# EasyEDA Pro project ProPrj_gpsdo-Phil1_2025-08-17.epro

# Schematic gpsdo
Board Name: gpsdo; Create Date: 2024-10-21; Page Name: gpsdo; Project Name: gpsdo-Phil1; Schematic Name: gpsdo; Update Date: 2024-11-19; Add into BOM: yes; Company: Your Company; Convert to PCB: yes; Date: 2024-08-26; Draw By: 一蓑烟雨任平生; REV: 1.0; Sheet: 1/1
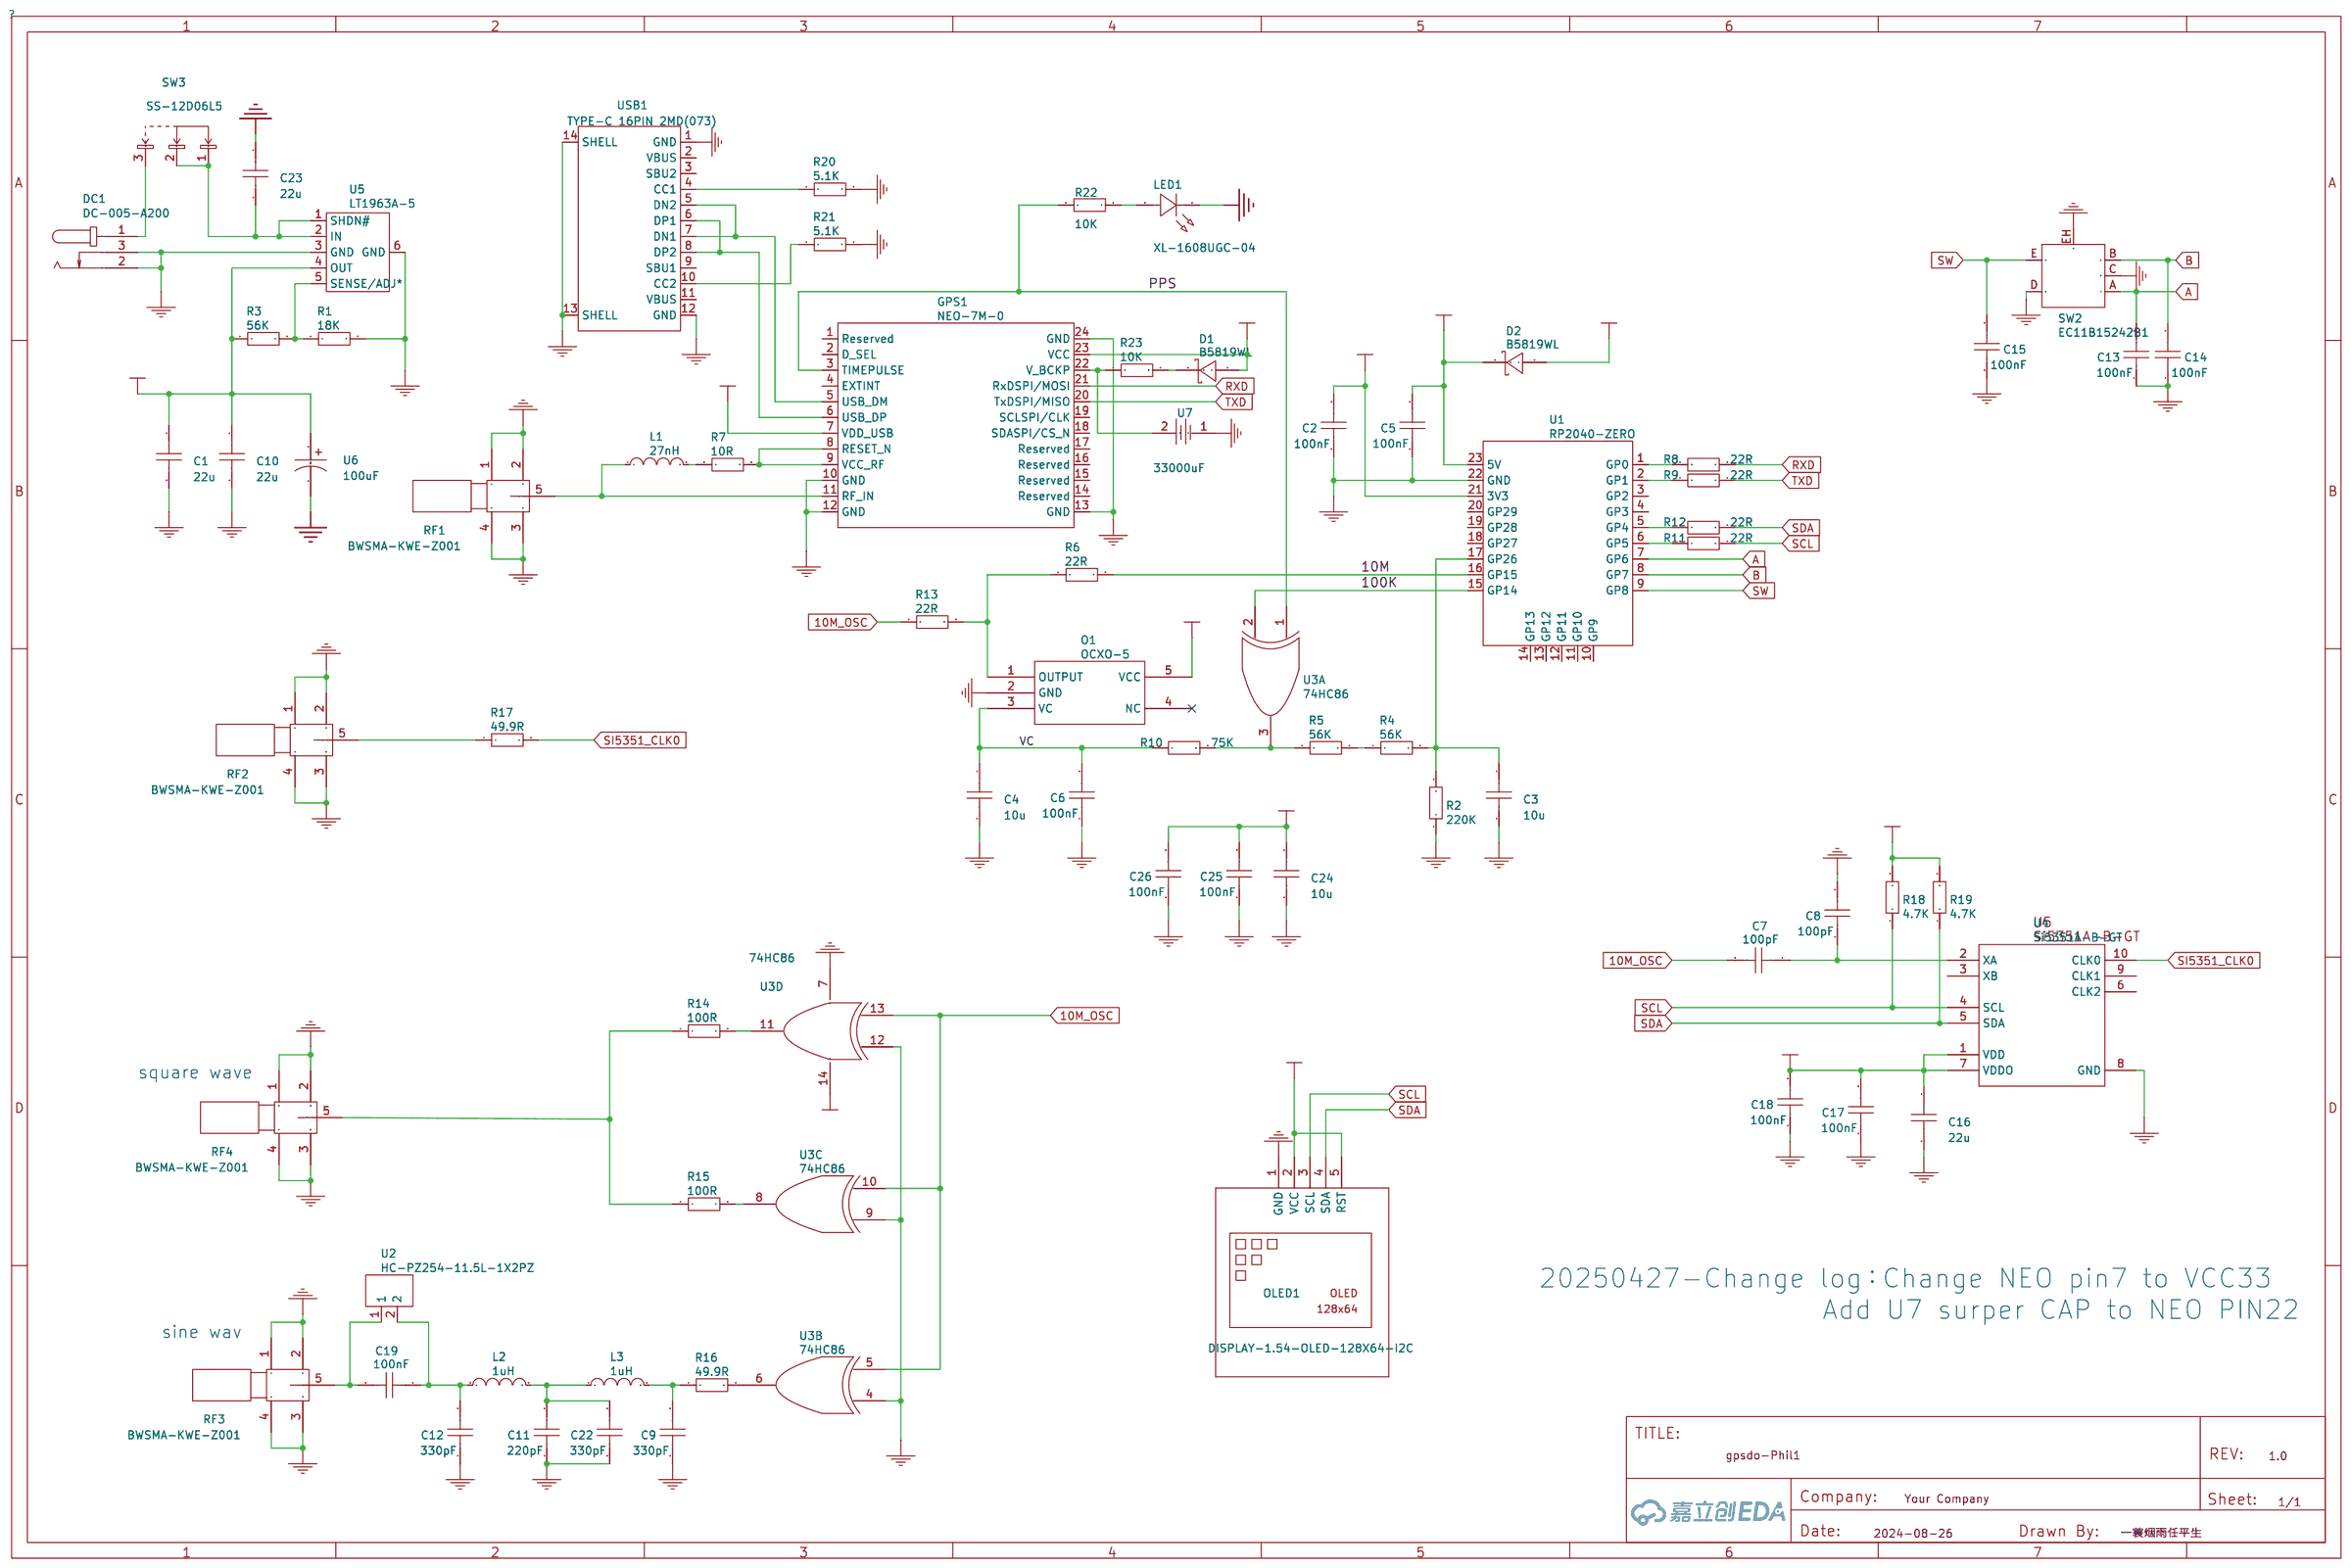
[diagram p0: schematic sheet]

## Parts
C1  22u  [C0805]
C2  100nF  [C0603]
C3  10u  [C0805]
C4  10u  [C0805]
C5  100nF  [C0603]
C6  100nF  [C0603]
C7  100pF  [C0603]
C8  100pF  [C0603]
C9  330pF  [C0603]
C10  22u  [C0805]
C11  220pF  [C0603]
C12  330pF  [C0603]
C13  100nF  [C0603]
C14  100nF  [C0603]
C15  100nF  [C0603]
C16  22u  [C0805]
C17  100nF  [C0603]
C18  100nF  [C0603]
C19  100nF  [C0603]
C22  330pF  [C0603]
C23  22u  [C0805]
C24  10u  [C0805]
C25  100nF  [C0603]
C26  100nF  [C0603]
D1  B5819WL  [SOD-123F_L2.8-W1.8-LS3.7-RD]
D2  B5819WL  [SOD-123F_L2.8-W1.8-LS3.7-RD]
DC1  DC-005-A200  [DC-IN-TH_DC-005-A200]
GPS1  NEO-7M-0  [GPS-SMD_NEO-7M-0]
L1  27nH  [L0603]
L2  1uH  [IND-SMD_L2.3-W1.7-1]
L3  1uH  [IND-SMD_L2.3-W1.7-1]
LED1  XL-1608UGC-04  [LED0603-RD_GREEN]
O1  OCXO-5  [OCXO-5]
OLED1  DISPLAY-1.54-OLED-128X64-I2C  [CONN-TH_XH2.54-5P]
R1  18K  [R0603]
R2  220K  [R0603]
R3  56K  [R0603]
R4  56K  [R0603]
R5  56K  [R0603]
R6  22R  [R0603]
R7  10R  [R0603]
R8  22R  [R0603]
R9  22R  [R0603]
R10  75K  [R0603]
R11  22R  [R0603]
R12  22R  [R0603]
R13  22R  [R0603]
R14  100R  [R0603]
R15  100R  [R0603]
R16  49.9R  [R0603]
R17  49.9R  [R0603]
R18  4.7K  [R0603]
R19  4.7K  [R0603]
R20  5.1K  [R0603]
R21  5.1K  [R0603]
R22  10K  [R0603]
R23  10K  [R0603]
RF1  BWSMA-KWE-Z001  [SMA-TH_BWSMA-KWE-Z001]
RF2  BWSMA-KWE-Z001  [SMA-TH_BWSMA-KWE-Z001]
RF3  BWSMA-KWE-Z001  [SMA-TH_BWSMA-KWE-Z001]
RF4  BWSMA-KWE-Z001  [SMA-TH_BWSMA-KWE-Z001]
SW2  EC11B15242B1  [SW-TH_EC11B1524XX]
SW3  SS-12D06L5  [SW-TH_3P-P4.70_L11.1-W12.7]
U1  RP2040-ZERO  [COMM-SMD_RP2040-ZERO]
U2  HC-PZ254-11.5L-1X2PZ  [CONN-TH_HC-PZ254-11.5L-1X2PZ]
U3  74HC86  [SOP-14]  (sections 1,2,3,4)
U4  Si5351A-B-GT  [SI5351A-B-GT-MSOP-10_L3.0-W3.0-P0.50-LS5.0-BL]
U5  LT1963A-5  [DD-PAK-5_L10.6-W10.3-P1.70-LS14.5-BR]
U6  100uF  [CAP-SMD_BD6.3-L6.6-W6.6-LS7.3-FD]
U7  33000uF  [BAT-SMD_SM3R3333-T01]
USB1  TYPE-C 16PIN 2MD(073)  [USB-C-SMD_TYPE-C-6PIN-2MD-073]

## Library data of the parts
C1 C3 C4 C10 C16 C23 C24 = CAP_0805: 容值:100nF;精度:±10%;额定电压:50V;温度系数:X7R;; Supplier Footprint: 0805
C2 C5 C6 C13-C15 C17-C19 C25 C26 = 100nF: Supplier: LCSC; Manufacturer: YAGEO; Manufacturer Part: CC0603KRX7R9BB104; Supplier Part: C14663; JLCPCB Part Class: Basic Part
C7 C8 = 100pF: Supplier: LCSC; Manufacturer: YAGEO; Manufacturer Part: CC0603KRX7R9BB104; Supplier Part: C14663; JLCPCB Part Class: Basic Part
C9 C12 C22 = 330pF: Supplier: LCSC; Manufacturer: YAGEO; Manufacturer Part: CC0603KRX7R9BB104; Supplier Part: C14663; JLCPCB Part Class: Basic Part
C11 = 220pF: Supplier: LCSC; Manufacturer: YAGEO; Manufacturer Part: CC0603KRX7R9BB104; Supplier Part: C14663; JLCPCB Part Class: Basic Part
D1 D2 = B5819WL: Supplier: LCSC; Manufacturer: SHIKUES(时科); Supplier Part: C112447; JLCPCB Part Class: Extended Part
DC1 = DC-005-A200: Supplier: LCSC; Supplier Part: C720557; Manufacturer: XUNPU(讯普); JLCPCB Part Class: Extended Part; link: https://so.szlcsc.com/global.html?k=C720557&amp;ref=editor
GPS1 = NEO-7M-0: Supplier: LCSC; Supplier Part: C6612031; Manufacturer: U-BLOX
L1 = 27nH: Supplier: LCSC; Supplier Part: C162649; Manufacturer: muRata(村田); JLCPCB Part Class: Extended Part
L2 L3 = 1uH: Supplier: LCSC; Supplier Part: C363974; Manufacturer: Sunltech(韩国顺磁); JLCPCB Part Class: Extended Part
LED1 = XL-1608UGC-04: 灯头类型:-;发光颜色:翠绿色;正向电压(VF):-;功率:80mW;正向电流:25mA;主波长:516nm~525nm;二极管配置:独立二极管;透镜颜色:无色透明透镜;色温:-;发光强度:-;发光角度:120°;载带方式:正贴;工作温度:-30℃~+85℃;; Supplier Part: C965804; Manufacturer: XINGLIGHT(成兴光); Supplier Footprint: 0603; JLCPCB Part Class: 扩展库; Datasheet: https://atta.szlcsc.com/upload/public/pdf/source/20221102/520D6E465E5CFD1609C8A4DBC80D4018.pdf; Supplier: LCSC; Emitted Color: 翠绿色; Power Dissipation: 80mW; Forward Current: 25mA; Dominant Wavelength: 516nm~525nm; Peak Wavelength: 534nm; Diode Configuration: 独立二极管; Lens Color: 无色透明透镜; Viewing Angle: 120°; Mounting Sytle: 正贴; Operating Temperature: -30℃~+85℃
O1 = OCXO-5
OLED1 = DISPLAY-1.54-OLED-128X64-I2C
R1 R23 = 2.4K: Supplier: LCSC; Manufacturer: UniOhm; Manufacturer Part: 0603WAF1002T5E; Supplier Part: C25804; JLCPCB Part Class: Basic
R2 = 220K: Supplier: LCSC; Manufacturer: UniOhm; Manufacturer Part: 0603WAF1002T5E; Supplier Part: C25804; JLCPCB Part Class: Basic
R3 = 10K: Supplier: LCSC; Manufacturer: UniOhm; Manufacturer Part: 0603WAF1002T5E; Supplier Part: C25804; JLCPCB Part Class: Basic
R4 R5 = 56K: Supplier: LCSC; Manufacturer: UniOhm; Manufacturer Part: 0603WAF1002T5E; Supplier Part: C25804; JLCPCB Part Class: Basic
R6 R8 R9 R11-R13 = 22R: Supplier: LCSC; Manufacturer: UniOhm; Manufacturer Part: 0603WAF1002T5E; Supplier Part: C25804; JLCPCB Part Class: Basic
R7 = 10R: Supplier: LCSC; Manufacturer: UniOhm; Manufacturer Part: 0603WAF1002T5E; Supplier Part: C25804; JLCPCB Part Class: Basic
R10 = 75K: Supplier: LCSC; Manufacturer: UniOhm; Manufacturer Part: 0603WAF1002T5E; Supplier Part: C25804; JLCPCB Part Class: Basic
R14 R15 = 100R: Supplier: LCSC; Manufacturer: UniOhm; Manufacturer Part: 0603WAF1002T5E; Supplier Part: C25804; JLCPCB Part Class: Basic
R16 R17 = 49.9R: Supplier: LCSC; Manufacturer: UniOhm; Manufacturer Part: 0603WAF1002T5E; Supplier Part: C25804; JLCPCB Part Class: Basic
R18 R19 R22 = 4.7K: Supplier: LCSC; Manufacturer: UniOhm; Manufacturer Part: 0603WAF1002T5E; Supplier Part: C25804; JLCPCB Part Class: Basic
R20 R21 = 5.1K: Supplier: LCSC; Manufacturer: UniOhm; Manufacturer Part: 0603WAF1002T5E; Supplier Part: C25804; JLCPCB Part Class: Basic
RF1-RF4 = BWSMA-KWE-Z001: Supplier: LCSC; Supplier Part: C496551; Manufacturer: BAT WIRELESS(蝙蝠无线); JLCPCB Part Class: Extended Part
SW2 = EC11B15242B1: Supplier: LCSC; Supplier Part: C470755; Manufacturer: ALPSALPINE(阿尔卑斯阿尔派); JLCPCB Part Class: Extended Part
SW3 = SS-12D06L5: 电路结构:单刀双掷;安装方式:侧插;开关颜色:黑色;额定电流(DC):3A;额定电压(DC):250V;额定电流(AC):3A;额定电压(AC):250V;机械寿命:1万次;; LCSC Part Name: 柄长5mm 卧插双档 滑动开关; Supplier Part: C319015; Manufacturer: XKB Connectivity(中国星坤); Supplier Footprint: 插件; JLCPCB Part Class: 扩展库; Datasheet: https://atta.szlcsc.com/upload/public/pdf/source/20211009/0D67854FD60FB1F6FE75130AD47C052C.pdf; Supplier: LCSC; Circuit: 单刀双掷; Actuator Style: 矩形柱状; Pin Style: PC引脚; Switch Length: 12.95mm; Switch Width: 6.6mm; Switch Height: 6.3mm; Mounting Style: 侧插; Actuator Color: 黑色; Current Rating (DC): 3A; Voltage Rating (DC): 250V; Current Rating (AC): 3A; Voltage Rating (AC): 250V; Mechanical Life: 1万次; Operating Temperature: -40℃~+85℃
U1 = RP2040-ZERO: Supplier: LCSC; Supplier Part: C5350143; Manufacturer: Waveshare(微雪电子); JLCPCB Part Class: Extended Part
U2 = HC-PZ254-11.5L-1X2PZ: Supplier: LCSC; Supplier Part: C27985187; Manufacturer: HC(虹成电子); Manufacturer Part: HC-PZ254-11.5L-1x2PZ
U3 = 74HC86
U4 = Si5351A-B-GT
U5 = LT1963A-5: Supplier: LCSC; Supplier Part: C665682; Manufacturer: Analog Devices; Manufacturer Part: LT1963AEQ-1.8#PBF; JLCPCB Part Class: Extended Part
U6 = 118EC221: 容值:100uF;精度:±20%;额定电压:25V;; LCSC Part Name: 100uF ±20% 25V; Supplier Part: C5361260; Manufacturer: KNSCHA(科尼盛); Supplier Footprint: SMD,D6.3xL5.9mm; JLCPCB Part Class: 扩展库; Datasheet: https://atta.szlcsc.com/upload/public/pdf/source/20230214/DF1300D15D4E0E75CD3AD09AED3A8200.pdf; Supplier: LCSC; Tolerance: ±20%; Rated Voltage: 25V
U7 = SM3R3333 T01: 容值:33000uF;精度:-20%~+80%;额定电压:3.3V;漏电流:100uA@30mins;等效串联电阻:200Ω@1kHz;; LCSC Part Name: 33000uF -20%~+80% 3.3V; Supplier Part: C260765; Manufacturer: KORCHIP(高奇普); Supplier Footprint: SMD,1.5x3.8mm; JLCPCB Part Class: 扩展库; Datasheet: https://atta.szlcsc.com/upload/public/pdf/source/20190514/C260765_F6ACC1E70F2A9EFDD36435F7B2A4C259.pdf; Supplier: LCSC; Tolerance: -20%~+80%; Rated Voltage: 3.3V; Leakage Current(DCL): 100uA@30mins; Equivalent Series Resistance(ESR): 200Ω@1kHz; Operating Temperature: -25℃~+60℃; φD: 3.8mm
USB1 = TYPE-C 16PIN 2MD(073): Supplier: LCSC; Supplier Part: C2765186; Manufacturer: SHOU HAN(首韩); JLCPCB Part Class: Extended Part

## Nets
+5V: C1.1 C10.1 C24.1 C25.2 C26.2 D2.2(A) O1.5(VCC) R3.1 U3.14 U5.4(OUT) U6.1
+5V_PICO: C5.2 D2.1(K) U1.23(5V)
GND: C1.2 C2.1 C3.2 C4.2 C5.1 C6.1 C8.2 C9.1 C10.2 C11.1 C12.1 C13.1 C14.1 C15.1 C16.2 C17.1 C18.1 C22.1 C23.1 C24.2 C25.1 C26.1 DC1.2 DC1.3 GPS1.10(GND) GPS1.12(GND) GPS1.13(GND) GPS1.24(GND) LED1.1(K) O1.2(GND) OLED1.1(GND) R1.2 R2.1 R20.2 R21.2 RF1.1 RF1.2 RF1.3 RF1.4 RF2.1 RF2.2 RF2.3 RF2.4 RF3.1 RF3.2 RF3.3 RF3.4 RF4.1 RF4.2 RF4.3 RF4.4 SW2.C SW2.D SW2.EH U1.22(GND) U3.4 U3.7 U3.9 U3.12 U4.8(GND) U5.3(GND) U5.6(GND) U6.2 U7.1 USB1.1(GND) USB1.12(GND) USB1.13(SHELL) USB1.14(SHELL)
VCC33: C2.2 C16.1 C17.2 C18.2 D1.2(A) GPS1.7(VDD_USB) GPS1.23(VCC) OLED1.2(VCC) OLED1.5(RST) R18.2 R19.2 U1.21(3V3) U4.1(VDD) U4.7(VDDO)
10M: R6.2 U1.16(GP15)
10M_OSC: C7.2 R13.1 U3.5 U3.10 U3.13
100K: U1.15(GP14) U3.2
A: C13.2 SW2.A U1.7(GP6)
B: C14.2 SW2.B U1.8(GP7)
PPS: GPS1.3(TIMEPULSE) R22.2 U3.1
RXD: GPS1.21(RxDSPI/MOSI) R8.2
SCL: OLED1.3(SCL) R11.2 R18.1 U4.4(SCL)
SDA: OLED1.4(SDA) R12.2 R19.1 U4.5(SDA)
SI5351_CLK0: R17.2 U4.10(CLK0)
SW: C15.2 SW2.E U1.9(GP8)
TXD: GPS1.20(TxDSPI/MISO) R9.2
VC: C4.1 C6.2 O1.3(VC) R10.1
$1N1: C23.2 SW3.1 SW3.2 U5.1(SHDN#) U5.2(IN)
$1N4: R1.1 R3.2 U5.5(SENSE/ADJ*)
$1N11: C3.1 R2.2 R4.2 U1.17(GP26)
$1N15: R4.1 R5.2
$1N20: O1.1(OUTPUT) R6.1 R13.2
$1N25: GPS1.11(RF_IN) L1.1 RF1.5
$1N26: GPS1.8(RESET_N) GPS1.9(VCC_RF) R7.2
$1N28: L1.2 R7.1
$1N35: R8.1 U1.1(GP0)
$1N36: R9.1 U1.2(GP1)
$1N37: R5.1 R10.2 U3.3
$1N42: R12.1 U1.5(GP4)
$1N43: R11.1 U1.6(GP5)
$1N54: R14.2 U3.11
$1N55: R15.2 U3.8
$1N56: R14.1 R15.1 RF4.5
$1N59: C7.1 C8.1 U4.2(XA)
$1N63: C11.2 C22.2 L2.2 L3.1
$1N64: C9.2 L3.2 R16.1
$1N65: C12.2 C19.1 L2.1 U2.2
$1N84: R17.1 RF2.5
$1N90: GPS1.6(USB_DP) USB1.6(DP1) USB1.8(DP2)
$1N91: GPS1.5(USB_DM) USB1.5(DN2) USB1.7(DN1)
$1N92: R20.1 USB1.4(CC1)
$1N93: R21.1 USB1.10(CC2)
$1N95: C19.2 RF3.5 U2.1
$1N1366: R16.2 U3.6
$1N3339: DC1.1 SW3.3
$1N3564: LED1.2(A) R22.1
$1N8329: D1.1(K) R23.2
$1N8333: GPS1.22(V_BCKP) R23.1 U7.2

Not connected (* = marked no-connect by the designer): GPS1 1(Reserved) 2(D_SEL) 4(EXTINT) 14(Reserved) 15(Reserved) 16(Reserved) 17(Reserved) 18(SDASPI/CS_N) 19(SCLSPI/CLK); O1 4(NC)*; U1 3(GP2) 4(GP3) 10(GP9) 11(GP10) 12(GP11) 13(GP12) 14(GP13) 18(GP27) 19(GP28) 20(GP29); U4 3(XB) 6(CLK2) 9(CLK1); USB1 2(VBUS) 3(SBU2) 9(SBU1) 11(VBUS)

## Notes on the sheet
- square wave
- 20250427-Change log：Change NEO pin7 to VCC33
- Add U7 surper CAP to NEO PIN22
- sine wav

# Board gpsdo-phil
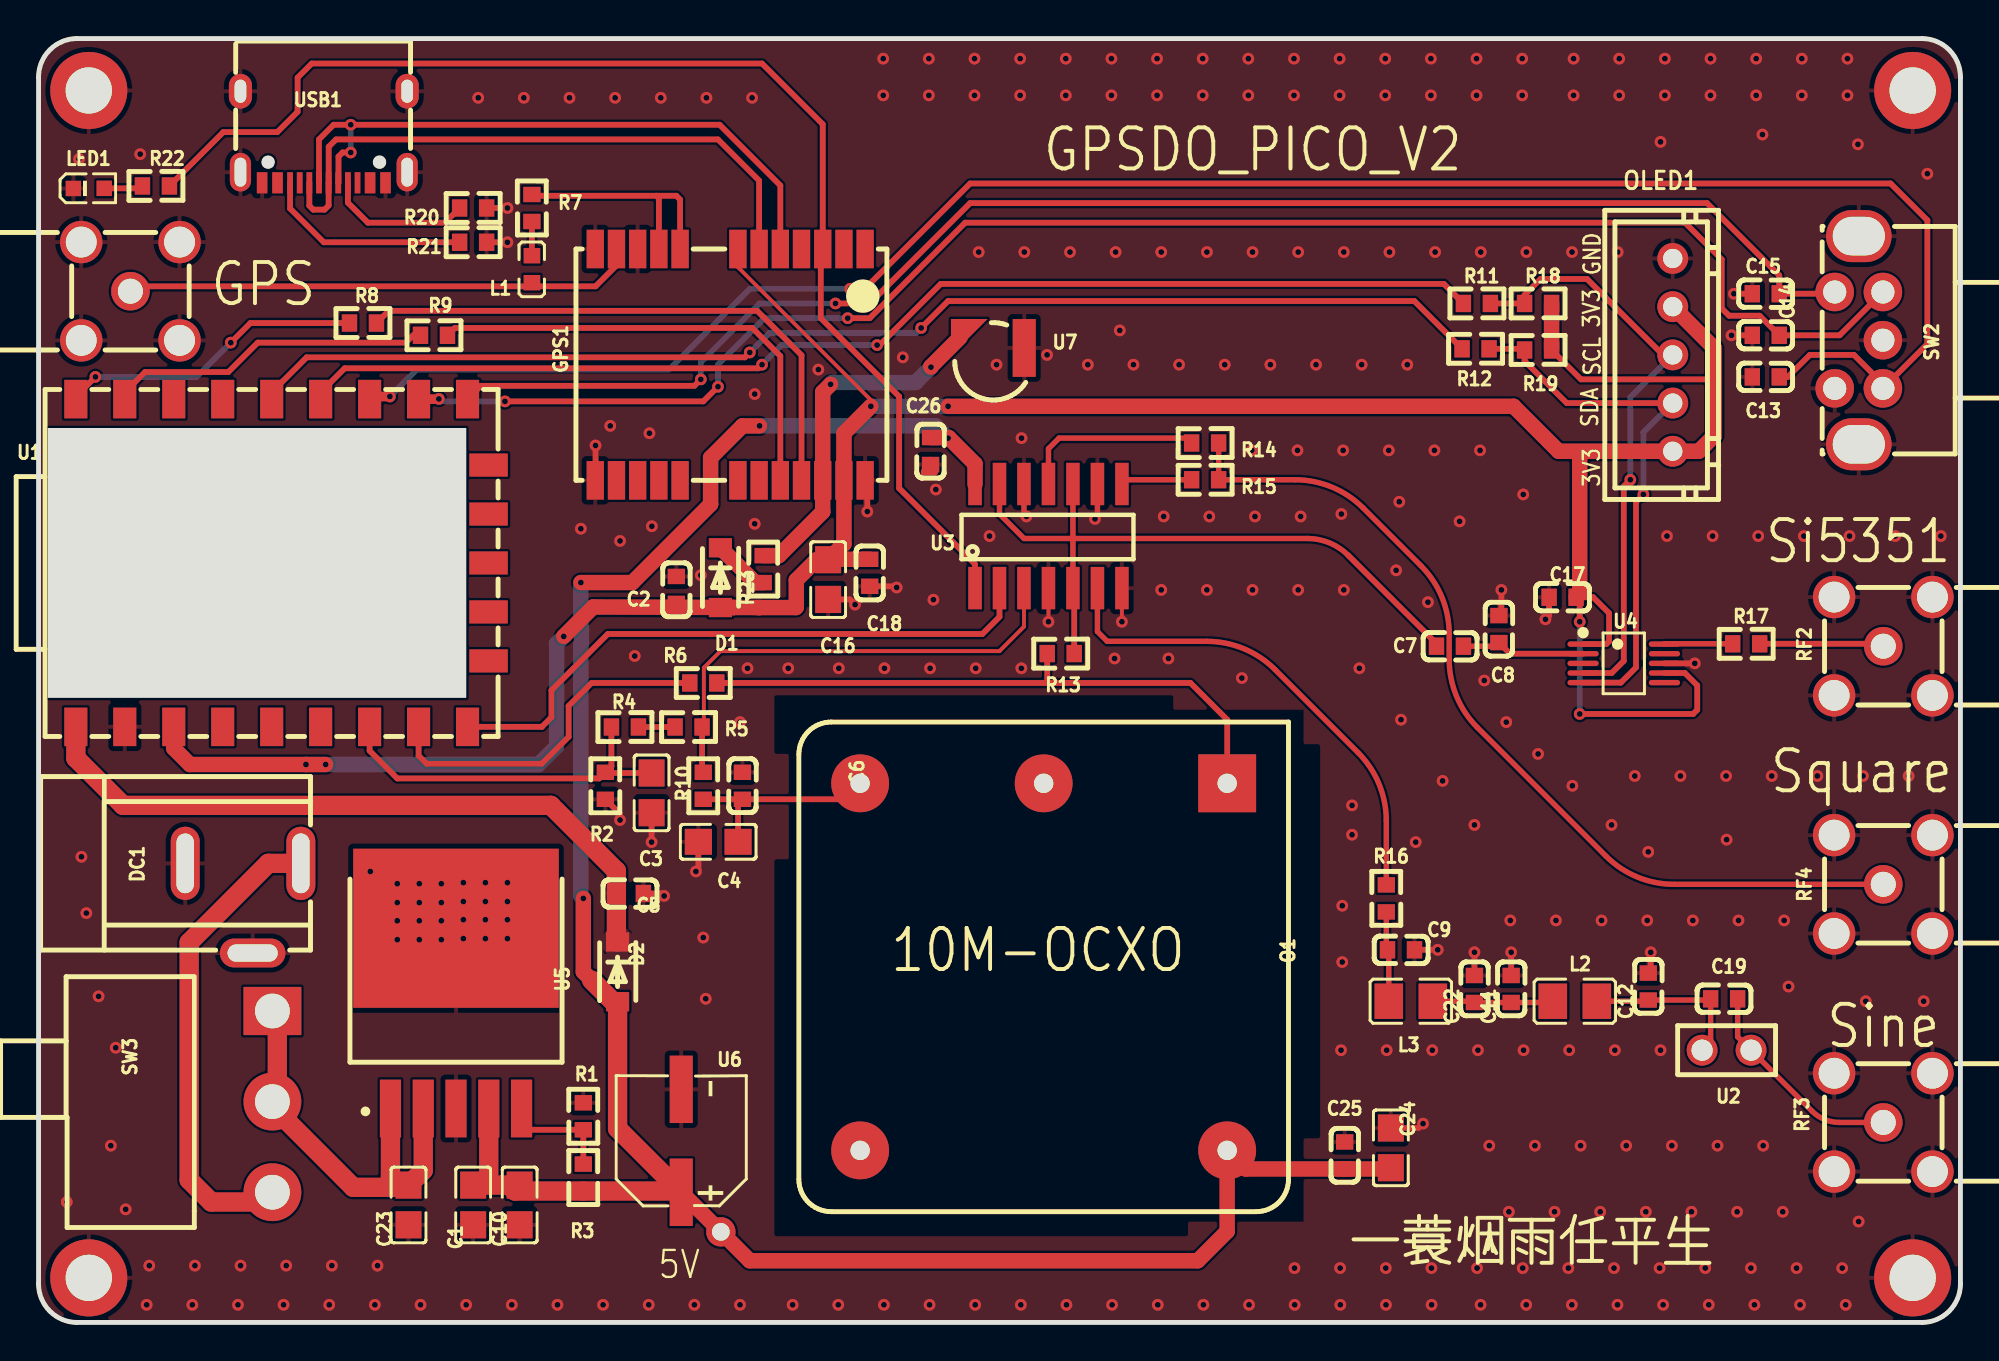
[diagram p1: board, top side]
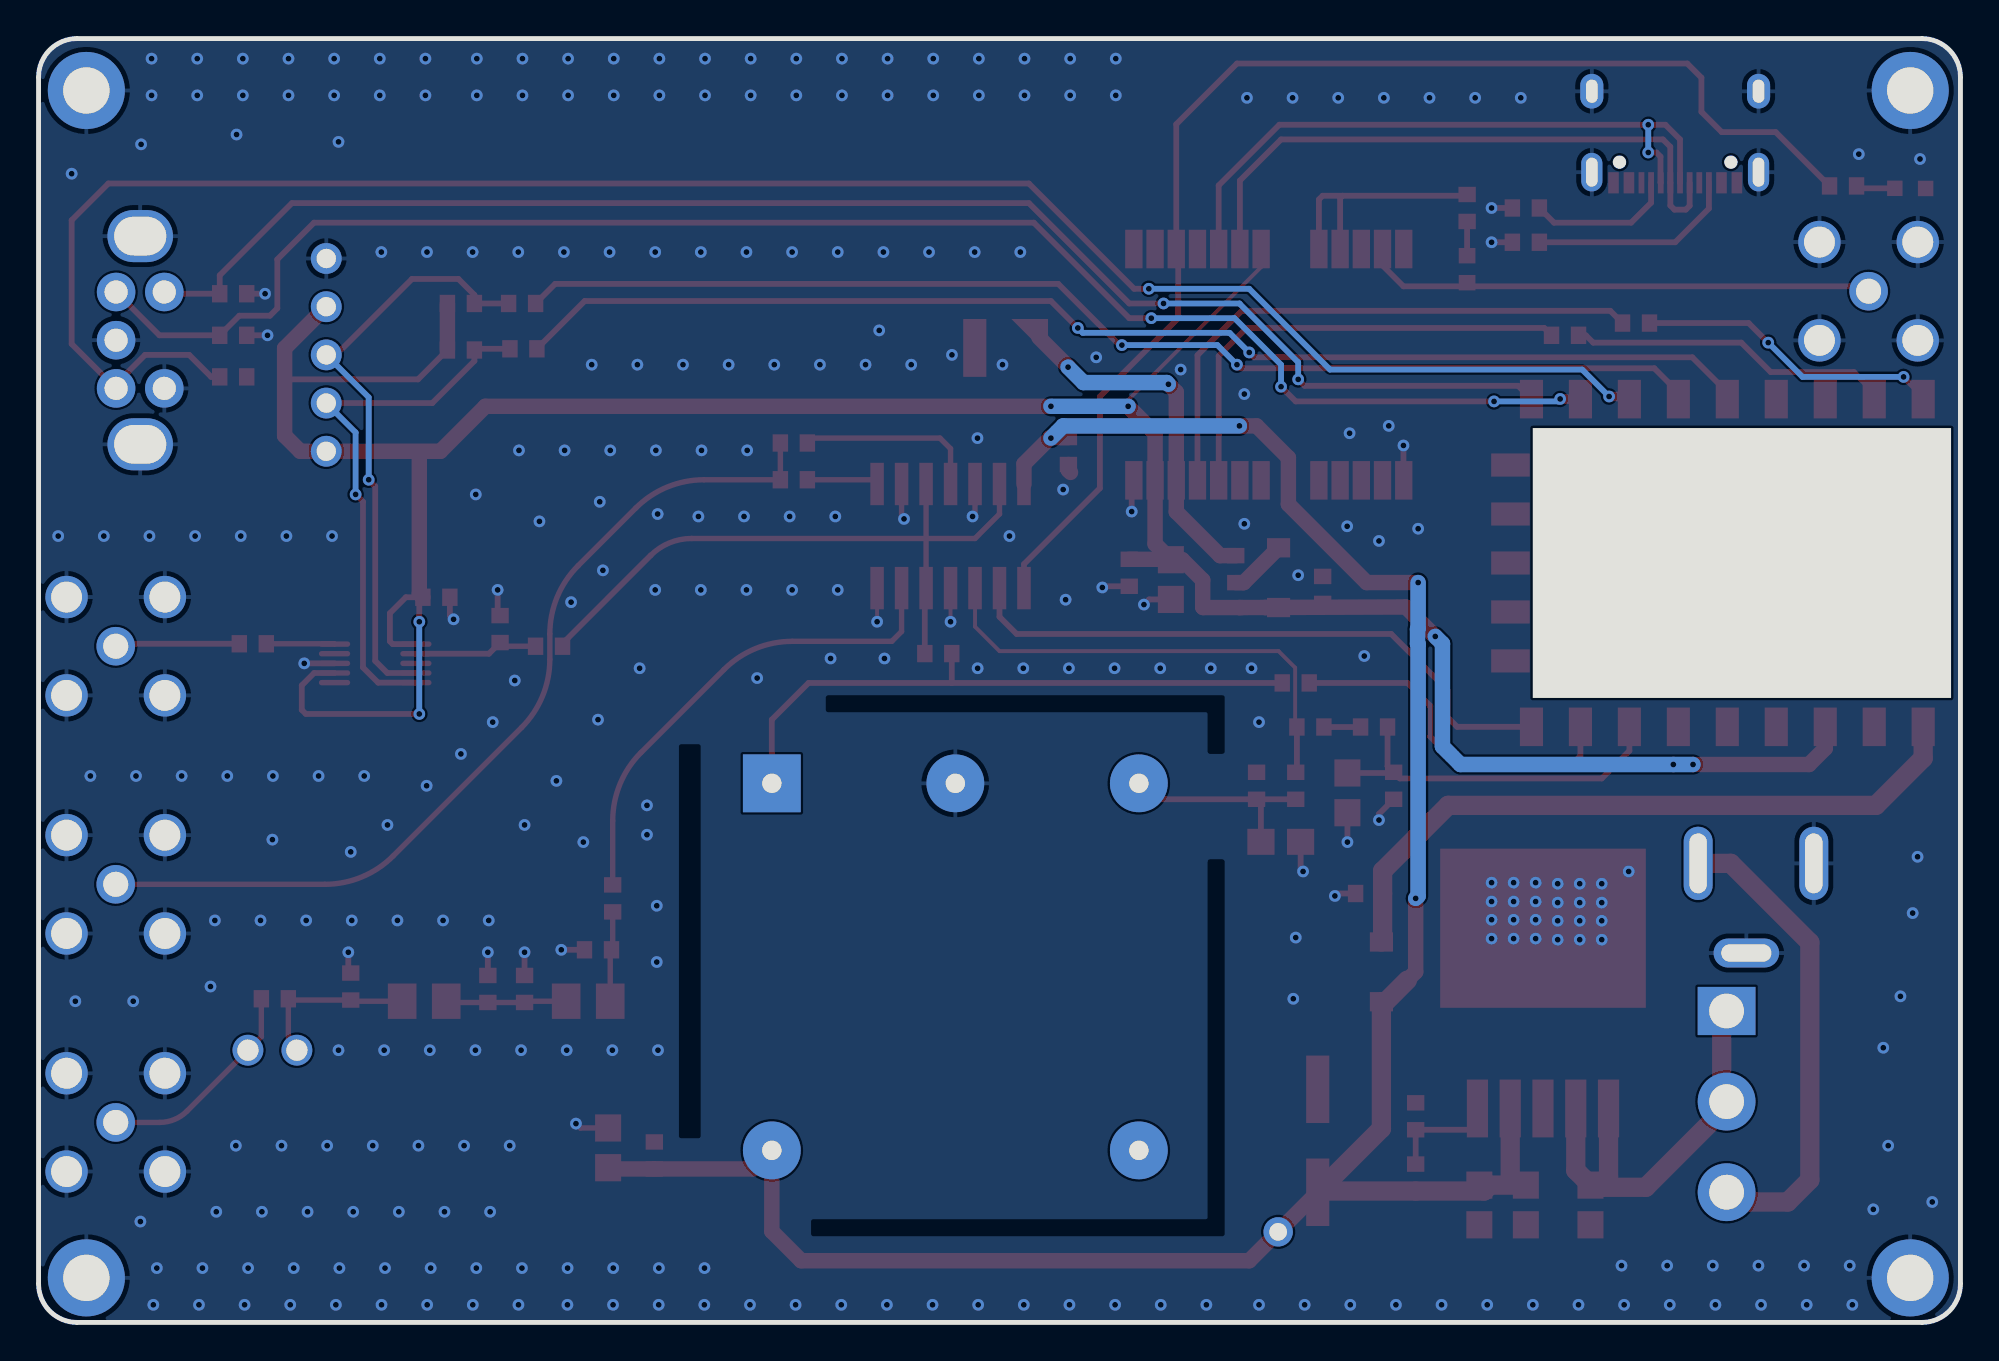
[diagram p2: board, bottom side, seen from below]

Outline 99.7 x 66.6 mm; copper layers: Top Layer, Bottom Layer. Coordinates in mm from the lower left corner of the outline.
Outline path: 0,64.6 0,2 arc(0.59,0.59) 2,0 97.7,0 arc(99.11,0.59) 99.7,2 99.7,64.6 arc(99.11,66.01) 97.7,66.6 2,66.6 arc(0.59,66.01) 0,64.6
Stack: Top Layer 0.035mm / Dielectric1 1.51mm FR4 er 4.5 / Bottom Layer 0.035mm

## Design rules (mm)
spacing Default (default): track to track 0.12, other pairs 0 to 0.12
track width Default (default): min 0.12, default 0.12, max 25.4
differential pair differentialPair (default): width min 0.127, default 0.254, max 2.54; gap min 0.152, default 0.152
via Default (default): diameter min 0.45, default 0.45, max 100.025; hole min 0.2, default 0.2, max 59.995

## Placement (name value [footprint] x y rotation side)
C1  22u  [C0805]  22.55 6.09 270 top
C2  100nF  [C0603]  33.09 38 270 top
C3  10u  [C0805]  31.8 27.47 270 top
C4  10u  [C0805]  35.26 24.93 180 top
C5  100nF  [C0603]  30.68 22.25 180 top
C6  100nF  [C0603]  36.52 27.84 270 top
C7  100pF  [C0603]  73.22 35.08 180 top
C8  100pF  [C0603]  75.76 35.97 90 top
C9  330pF  [C0603]  70.68 19.33 180 top
C10  22u  [C0805]  24.96 6.09 270 top
C11  220pF  [C0603]  76.39 17.3 270 top
C12  330pF  [C0603]  83.5 17.43 270 top
C13  100nF  [C0603]  89.6 49.05 0 top
C14  100nF  [C0603]  89.6 51.21 0 top
C15  100nF  [C0603]  89.6 53.36 0 top
C16  22u  [C0805]  40.96 38.54 270 top
C17  100nF  [C0603]  79.06 37.62 0 top
C18  100nF  [C0603]  43.12 38.89 90 top
C19  100nF  [C0603]  87.44 16.79 0 top
C22  330pF  [C0603]  74.49 17.3 270 top
C23  22u  [C0805]  19.19 6.09 90 top
C24  10u  [C0805]  70.15 9.06 90 top
C25  100nF  [C0603]  67.76 8.66 270 top
C26  100nF  [C0603]  46.27 45.2 90 top
D1  B5819WL  [SOD-123F_L2.8-W1.8-LS3.7-RD]  35.37 38.63 270 top
D2  B5819WL  [SOD-123F_L2.8-W1.8-LS3.7-RD]  30.04 18.19 270 top
DC1  DC-005-A200  [DC-IN-TH_DC-005-A200]  10.61 21.49 0 top
GPS1  NEO-7M-0  [GPS-SMD_NEO-7M-0]  35.88 49.68 180 top
L1  27nH  [L0603]  25.59 54.64 90 top
L2  1uH  [IND-SMD_L2.3-W1.7-1]  79.69 16.66 180 top
L3  1uH  [IND-SMD_L2.3-W1.7-1]  71.19 16.66 180 top
LED1  XL-1608UGC-04  [LED0603-RD_GREEN]  2.61 58.83 0 top
NOREF  -  [Pad_e4136]  2.61 2.31 0 top
NOREF#2  -  [Pad_e4129]  97.22 63.91 0 top
NOREF#3  -  [Pad_e4128]  2.61 63.91 0 top
NOREF#4  -  [Pad_e4137]  97.22 2.31 0 top
NOREF#5  -  [Pad_e296]  35.4 4.7 0 top
O1  -  [OCXO-5]  61.66 27.97 270 top
OLED1  DISPLAY-1.54-OLED-128X64-I2C  [CONN-TH_XH2.54-5P]  84.78 50.19 270 top
R1  18K  [R0603]  28.26 10.69 90 top
R2  220K  [R0603]  29.4 27.84 90 top
R3  56K  [R0603]  28.26 7.52 90 top
R4  56K  [R0603]  30.42 30.89 180 top
R5  56K  [R0603]  33.72 30.89 180 top
R6  22R  [R0603]  34.48 33.17 180 top
R7  10R  [R0603]  25.59 57.81 90 top
R8  22R  [R0603]  16.83 51.84 0 top
R9  22R  [R0603]  20.51 51.21 0 top
R10  75K  [R0603]  34.48 27.84 90 top
R11  22R  [R0603]  74.62 52.86 0 top
R12  22R  [R0603]  74.55 50.51 0 top
R13  22R  [R0603]  53.03 34.7 180 top
R14  100R  [R0603]  60.52 45.62 180 top
R15  100R  [R0603]  60.52 43.71 180 top
R16  49.9R  [R0603]  69.92 22 90 top
R17  49.9R  [R0603]  88.59 35.21 180 top
R18  4.7K  [R0603]  77.79 52.86 0 top
R19  4.7K  [R0603]  77.79 50.45 0 top
R20  5.1K  [R0603]  22.55 57.81 0 top
R21  5.1K  [R0603]  22.55 56.03 0 top
R22  10K  [R0603]  6.09 58.95 0 top
R23  10K  [R0603]  37.59 39.08 270 top
RF1  BWSMA-KWE-Z001  [SMA-TH_BWSMA-KWE-Z001]  4.77 53.49 180 top
RF2  BWSMA-KWE-Z001  [SMA-TH_BWSMA-KWE-Z001]  95.7 35.08 0 top
RF3  BWSMA-KWE-Z001  [SMA-TH_BWSMA-KWE-Z001]  95.7 10.38 0 top
RF4  BWSMA-KWE-Z001  [SMA-TH_BWSMA-KWE-Z001]  95.7 22.73 0 top
SW2  EC11B15242B1  [SW-TH_EC11B1524XX]  94.43 50.95 0 top
SW3  SS-12D06L5  [SW-TH_3P-P4.70_L11.1-W12.7]  12.13 11.46 270 top
U1  RP2040-ZERO  [COMM-SMD_RP2040-ZERO]  12.64 39.4 90 top
U2  HC-PZ254-11.5L-1X2PZ  [CONN-TH_HC-PZ254-11.5L-1X2PZ]  87.57 14.12 180 top
U3  74HC86  [SOP-14]  52.39 40.79 0 top
U4  Si5351A-B-GT  [SI5351A-B-GT-MSOP-10_L3.0-W3.0-P0.50-LS5.0-BL]  82.24 34.19 270 top
U5  LT1963A-5  [DD-PAK-5_L10.6-W10.3-P1.70-LS14.5-BR]  21.66 15.77 270 top
U6  100uF  [CAP-SMD_BD6.3-L6.6-W6.6-LS7.3-FD]  33.34 9.42 90 top
U7  33000uF  [BAT-SMD_SM3R3333-T01]  49.47 50.83 90 top
USB1  TYPE-C 16PIN 2MD(073)  [USB-C-SMD_TYPE-C-6PIN-2MD-073]  14.8 61.49 180 top

## Footprints (pads in the part's own frame, mm; a bottom-side part is the same pattern mirrored in y, then rotated)
BAT-SMD_SM3R3333-T01
  rect 3x1.2 smd: 1(-0.275,-1.663)
  custom 1.9x1.9 smd: 2(0.275,1.663)
C0603
  rect 0.8x0.9 smd: 1(-0.7,0) 2(0.7,0)
C0805
  rect 1.41x1.35 smd: 1(-1.03,0) 2(1.03,0)
CAP-SMD_BD6.3-L6.6-W6.6-LS7.3-FD
  rect 3.5x1.2 smd: 1(-2.67,0) 2(2.67,0)
COMM-SMD_RP2040-ZERO
  rect 2x1.2 smd: 1(8.5,10.705) 2(8.5,8.165) 3(8.5,5.625) 4(8.5,3.085) 5(8.5,0.545) 6(8.5,-1.995) 7(8.5,-4.535) 8(8.5,-7.075) 9(8.5,-9.615) 15(-8.5,-9.615) 16(-8.5,-7.075) 17(-8.5,-4.535) 18(-8.5,-1.995) 19(-8.5,0.545) 20(-8.5,3.085) 21(-8.5,5.625) 22(-8.5,8.165) 23(-8.5,10.705)
  rect 1.2x2 smd: 10(5.08,-10.705) 11(2.54,-10.705) 12(0,-10.705) 13(-2.54,-10.705) 14(-5.08,-10.705)
CONN-TH_HC-PZ254-11.5L-1X2PZ
  round 1.6 hole 1.1: 1(-1.27,0) 2(1.27,0)
CONN-TH_XH2.54-5P
  round 1.6 hole 1: 1(-5,0) 2(-2.5,0) 3(0,0) 4(2.5,0) 5(5,0)
DC-IN-TH_DC-005-A200
  oval 1.5x3.8 hole 0.9x3.1: 1(3,2.325) 2(-2.999,2.325)
  oval 3.4x1.5 hole 2.6x0.9: 3(0.5,-2.325)
DD-PAK-5_L10.6-W10.3-P1.70-LS14.5-BR
  rect 3x1.1 smd: 1(4.675,-3.4) 2(4.675,-1.7) 3(4.675,0) 4(4.675,1.7) 5(4.675,3.4)
  rect 8.255x10.668 smd: 6(-4.675,0)
GPS-SMD_NEO-7M-0
  rect 0.9x2 smd: 1(-7,-6) 2(-5.9,-6) 3(-4.8,-6) 4(-3.7,-6) 5(-2.6,-6) 6(-1.5,-6) 7(-0.4,-6) 8(2.6,-6) 9(3.7,-6) 10(4.8,-6) 11(5.9,-6) 12(7,-6) 13(7,6) 14(5.9,6) 15(4.8,6) 16(3.7,6) 17(2.6,6) 18(-0.4,6) 19(-1.5,6) 20(-2.6,6) 21(-3.7,6) 22(-4.8,6) 23(-5.9,6) 24(-7,6)
IND-SMD_L2.3-W1.7-1
  rect 1.485x1.836 smd: 1(-1.143,0) 2(1.143,0)
L0603
  rect 0.8x0.864 smd: 1(-0.7,0) 2(0.7,0)
LED0603-RD_GREEN
  rect 0.8x0.8 smd: 1(-0.799,-0.004) 2(0.799,0.004)
OCXO-5
  rect 3x3 hole 1: 1(0,0)
  round 3 hole 1.005x1: 2(0,-9.52) 4(19.04,-19.04) 5(19.04,0)
  round 3 hole 1: 3(0,-19.04)
Pad_e296
  round 1.524 hole 0.914: 1(0,0)
Pad_e4128
  round 4 hole 2.4: 1(0,0)
Pad_e4129
  round 4 hole 2.4: 1(0,0)
Pad_e4136
  round 4 hole 2.4: 1(0,0)
Pad_e4137
  round 4 hole 2.4: 1(0,0)
R0603
  rect 0.8x0.9 smd: 1(-0.7,0) 2(0.7,0)
SI5351A-B-GT-MSOP-10_L3.0-W3.0-P0.50-LS5.0-BL
  oval 0.28x1.62 smd: 1(-1,-2.11) 2(-0.5,-2.11) 3(0,-2.11) 4(0.5,-2.11) 5(1,-2.11) 6(1,2.11) 7(0.5,2.11) 8(0,2.11) 9(-0.5,2.11) 10(-1,2.11)
SMA-TH_BWSMA-KWE-Z001
  round 2.2 hole 1.6: 1(-2.55,-2.55) 2(-2.55,2.55) 3(2.55,2.55) 4(2.55,-2.55)
  round 2 hole 1.3: 5(0,0)
SOD-123F_L2.8-W1.8-LS3.7-RD
  rect 1x1.2 smd: 1(-1.55,0) 2(1.55,0)
SOP-14
  rect 0.701x2.2 smd: 1(-3.81,-2.7) 2(-2.54,-2.7) 3(-1.27,-2.7) 4(0,-2.7) 5(1.27,-2.7) 6(2.54,-2.7) 7(3.81,-2.7) 8(3.81,2.7) 9(2.54,2.7) 10(1.27,2.7) 11(0,2.7) 12(-1.27,2.7) 13(-2.54,2.7) 14(-3.81,2.7)
SW-TH_3P-P4.70_L11.1-W12.7
  rect 2.5x3 hole 1.8: 1(-4.7,0)
  round 3 hole 1.8: 2(0,0) 3(4.7,0)
SW-TH_EC11B1524XX
  round 2 hole 1.2: A(1.25,-2.5) B(1.25,2.5) C(1.25,-0.001) D(-1.25,-2.5) E(-1.25,2.5)
  oval 3.4x2.7 hole 2.7x2: EH(0,5.4) EH(0,-5.4)
USB-C-SMD_TYPE-C-6PIN-2MD-073
  rect 0.55x1.1 smd: 1(-3.2,2.375) 2(-2.4,2.375) 11(2.401,2.375) 12(3.2,2.375)
  rect 0.3x1.1 smd: 3(-1.75,2.375) 4(-1.25,2.375) 5(-0.75,2.375) 6(-0.25,2.375) 7(0.25,2.375) 8(0.75,2.375) 9(1.25,2.375) 10(1.75,2.375)
  oval 1.1x2 hole 0.6x1.5: 13(-4.325,1.825) 14(4.325,1.825)
  oval 1.2x1.8 hole 0.6x1.2: 13(-4.325,-2.375) 14(4.325,-2.375)

## Nets
As in the schematic, except:
+5V: C1.1 C10.1 C24.1 C25.2 C26.2 D2.2 NOREF#5.1 O1.5 R3.1 U3.14 U5.4 U6.1
GND: C1.2 C2.1 C3.2 C4.2 C5.1 C6.1 C8.2 C9.1 C10.2 C11.1 C12.1 C13.1 C14.1 C15.1 C16.2 C17.1 C18.1 C22.1 C23.1 C24.2 C25.1 C26.1 DC1.2 DC1.3 GPS1.10 GPS1.12 GPS1.13 GPS1.24 LED1.1 NOREF.1 NOREF#2.1 NOREF#3.1 NOREF#4.1 O1.2 OLED1.1 R1.2 R2.1 R20.2 R21.2 RF1.1 RF1.2 RF1.3 RF1.4 RF2.1 RF2.2 RF2.3 RF2.4 RF3.1 RF3.2 RF3.3 RF3.4 RF4.1 RF4.2 RF4.3 RF4.4 SW2.C SW2.D SW2.EH U1.22 U3.4 U3.7 U3.9 U3.12 U4.8 U5.3 U5.6 U6.2 U7.1 USB1.1 USB1.12 USB1.13 USB1.14

Pads without a net: GPS1 1 2 4 14 15 16 17 18 19; O1 4; U1 3 4 10 11 12 13 14 18 19 20; U4 3 6 9; USB1 2 3 9 11

## Via types
v1: diameter 0.61, hole 0.305, Top Layer to Bottom Layer, 339 vias

## Routing (per net, layer and track width the routed paths; a pad name or vN(x,y) marks a point on that pad's centre or on a via; arc(x,y) is an arc through that point)
+5V: length 120.5
  Top Layer w0.8: U6.1 NOREF#5.1 36.89,3.2 60.14,3.2 61.66,4.72 O1.5 62.62,7.96 C25.2 70.09,7.96 C24.1 ; C26.2 47.21,45.9 48.58,44.53 U3.14 ; v1(28.13,38.38) 30.8,38.38 34.86,42.44 34.86,44.86 36.52,46.51 v1(37.4,46.51) ; v1(28.26,22) 28.26,18.19 28.69,17.76
  Top Layer w1: 30.04,16.41 30.04,10.06 33.28,6.82 R3.1 24.72,6.82 24.41,7.12 ; 30.04,16.41 28.69,17.76 ; 30.04,16.41 30.04,16.64 ; U5.4 23.36,7.52 ; 24.41,7.12 C10.1 ; 24.41,7.12 C1.1
  Bottom Layer w0.8: v1(28.13,38.38) 28.13,36 28.16,35.97 28.16,35.21 28.13,35.17 28.13,22.12 v1(28.26,22) ; v1(47.18,45.87) 46.55,46.51 v1(37.4,46.51)
+5V_PICO: length 35.8
  Top Layer w1: D2.1 29.98,19.8 C5.2 29.98,23.42 26.57,26.82 4.38,26.82 1.93,29.27 U1.23
GND: length 34.5
  Top Layer w0.203: U3.4 v1(52.39,36.35) ; U3.7 v1(56.2,36.35)
  Top Layer w0.28: v1(51.25,41.81) 51.12,41.94 U3.12 ; C24.2 71.59,10.09 v1(71.82,10.31) ; v1(54.8,41.68) 54.93,41.81 U3.9
  Top Layer w0.3: v1(78.17,36.48) 78.36,36.67 C17.1 ; C11.1 v1(76.39,19.2) ; C5.1 32.32,22.25 v1(32.45,22.12) ; C8.2 75.88,36.79 v1(75.88,38) ; C22.1 v1(74.49,19.2) ; v1(42.36,37.24) 42.09,37.51 C16.2 ; R20.2 v1(24.32,57.81) ; C3.2 v1(31.8,24.92) ; v1(28.9,45.49) 28.9,43.7 GPS1.13 ; U4.8 v1(85.92,34.19) ; C18.1 44.45,38.19 v1(44.52,38.13) ; C4.2 34.23,23.52 v1(34.1,23.39) ; v1(42.99,42.06) 42.99,43.57 GPS1.24 ; v1(30.16,26.06) 30.16,26.38 R2.1 ; R21.2 v1(24.32,56.03) ; C14.1 v1(87.82,51.21) ; v1(83.63,19.2) 83.63,18.25 83.5,18.12 ; C9.1 v1(72.58,19.33) ; C15.1 v1(87.95,53.36)
  Top Layer w0.8: 46.17,44.1 46.27,44.2 C26.1
  vias: v1(1.46,6.25) v1(2.1,60.35) v1(2.23,24.16) v1(2.48,21.23) v1(3.11,16.92) v1(3.75,9.17) v1(4,14.25) v1(4.52,5.87) v1(5.27,60.61) v1(5.61,0.91) v1(5.74,2.95) v1(7.98,0.91) v1(8.11,2.95) v1(10.34,0.91) v1(10.48,2.95) v1(12.71,0.91) v1(12.85,2.95) v1(15.08,0.91) v1(15.22,2.95) v1(17.21,23.39) v1(17.45,0.91) v1(17.58,2.95) v1(18.61,22.76) v1(18.61,21.78) v1(18.61,20.84) v1(18.61,19.86) v1(19.75,22.76) v1(19.75,21.78) v1(19.75,20.84) v1(19.75,19.86) v1(19.81,0.91) v1(20.89,22.76) v1(20.89,21.78) v1(20.89,20.84) v1(20.89,19.86) v1(22.04,22.81) v1(22.04,21.83) v1(22.04,20.89) v1(22.04,19.91) v1(22.18,0.91) v1(22.81,63.53) v1(23.18,22.81) v1(23.18,21.83) v1(23.18,20.89) v1(23.18,19.91) v1(24.32,22.81) v1(24.32,21.83) v1(24.32,20.89) v1(24.32,19.91) v1(24.55,0.91) v1(25.18,63.53) v1(26.92,0.91) v1(27.54,63.53) v1(28.13,41.17) v1(29.28,0.91) v1(29.66,46.51) v1(29.91,63.53) v1(30.16,40.54) v1(30.93,34.57) v1(31.69,46.13) v1(31.65,0.91) v1(31.82,41.3) v1(32.28,63.53) v1(34.02,0.91) v1(34.36,38.76) v1(34.48,19.97) v1(34.65,63.53) v1(34.61,16.79) v1(36.39,31.14) v1(36.39,0.91) v1(36.78,33.94) v1(37.01,63.53) v1(37.15,48.16) v1(37.15,41.43) v1(38.89,33.94) v1(39.12,0.91) v1(40.45,49.43) v1(41.49,0.91) v1(41.51,33.94) v1(43.82,65.56) v1(43.82,63.65) v1(43.88,33.94) v1(43.85,0.91) v1(44.83,50.06) v1(46.19,65.56) v1(46.19,63.65) v1(46.25,33.94) v1(46.22,0.91) v1(46.42,37.49) v1(46.55,43.21) v1(48.55,65.56) v1(48.55,63.65) v1(48.59,0.91) v1(48.62,33.94) v1(48.77,55.53) v1(49.33,40.79) v1(49.7,49.68) v1(50.92,65.56) v1(50.92,63.65) v1(50.99,45.87) v1(50.98,33.94) v1(50.96,0.91) v1(51.14,55.53) v1(52.32,50.19) v1(53.29,65.56) v1(53.29,63.65) v1(53.32,0.91) v1(53.51,55.53) v1(54.43,49.68) v1(55.66,65.56) v1(55.66,63.65) v1(55.69,0.91) v1(55.87,55.53) v1(55.82,34.44) v1(56.09,51.46) v1(56.8,49.68) v1(58.02,65.56) v1(58.02,63.65) v1(58.06,0.91) v1(58.24,55.53) v1(58.24,38) v1(58.37,41.81) v1(58.61,34.44) v1(59.17,49.68) v1(60.39,65.56) v1(60.39,63.65) v1(60.43,0.91) v1(60.61,55.53) v1(60.61,38) v1(60.74,41.81) v1(61.53,49.68) v1(62.42,33.43) v1(62.76,65.56) v1(62.76,63.65) v1(62.8,0.91) v1(62.98,55.53) v1(62.94,45.24) v1(62.98,38) v1(63.1,41.81) v1(63.9,49.68) v1(65.13,65.56) v1(65.13,63.65) v1(65.15,2.82) v1(65.16,0.91) v1(65.31,45.24) v1(65.34,55.53) v1(65.34,38) v1(65.47,41.81) v1(66.27,49.68) v1(67.49,65.56) v1(67.49,63.65) v1(67.58,41.94) v1(67.57,14.12) v1(67.52,2.82) v1(67.53,0.91) v1(67.68,45.24) v1(67.63,21.62) v1(67.63,18.7) v1(67.71,55.53) v1(67.71,38) v1(68.14,26.82) v1(68.14,25.3) v1(68.52,33.94) v1(68.64,49.68) v1(69.86,65.56) v1(69.86,63.65) v1(69.89,2.82) v1(69.9,0.91) v1(69.93,14.12) v1(70.08,55.53) v1(70.04,45.24) v1(70.42,39.02) v1(70.59,42.57) v1(70.68,31.27) v1(71,49.68) v1(71.44,24.92) v1(72.08,37.36) v1(72.23,65.56) v1(72.23,63.65) v1(72.3,14.12) v1(72.26,2.82) v1(72.27,0.91) v1(72.45,55.53) v1(72.41,45.24) v1(72.84,28.09) v1(73.72,41.56) v1(74.49,25.81) v1(74.6,65.56) v1(74.6,63.65) v1(74.67,14.12) v1(74.62,2.82) v1(74.78,45.24) v1(74.81,0.91) v1(74.81,55.53) v1(75,33.3) v1(75.26,9.17) v1(76.14,31.14) v1(76.28,5.74) v1(76.35,20.85) v1(76.96,65.56) v1(76.96,63.65) v1(76.99,2.82) v1(77.02,42.95) v1(77.04,14.12) v1(77.18,55.53) v1(77.17,0.91) v1(77.63,9.17) v1(77.79,29.49) v1(78.64,5.74) v1(78.72,20.85) v1(79.4,14.12) v1(79.36,2.82) v1(79.55,55.53) v1(79.57,27.84) v1(79.54,0.91) v1(79.63,65.56) v1(79.63,63.65) v1(79.99,9.17) v1(81.08,20.85) v1(81.01,5.74) v1(81.6,25.81) v1(81.77,14.12) v1(81.73,2.82) v1(82,65.56) v1(82,63.65) v1(81.92,55.53) v1(81.91,0.91) v1(82.36,9.17) v1(82.81,28.35) v1(83.38,5.74) v1(83.5,24.41) v1(83.45,20.85) v1(84.09,2.82) v1(84.14,61.24) v1(84.14,14.12) v1(84.28,0.91) v1(84.37,65.56) v1(84.37,63.65) v1(84.48,40.79) v1(84.73,9.17) v1(85.17,28.35) v1(85.75,5.74) v1(85.82,20.85) v1(86.46,2.82) v1(86.64,0.91) v1(86.73,65.56) v1(86.73,63.65) v1(86.84,40.79) v1(87.1,9.17) v1(87.54,28.35) v1(87.57,25.05) v1(88.19,20.85) v1(88.11,5.74) v1(88.83,2.82) v1(89.1,65.56) v1(89.1,63.65) v1(89.01,0.91) v1(89.21,40.79) v1(89.43,61.62) v1(89.47,9.17) v1(89.91,28.35) v1(90.48,5.74) v1(90.55,20.85) v1(90.78,17.43) v1(91.2,2.82) v1(91.38,0.91) v1(91.47,65.56) v1(91.47,63.65) v1(91.58,40.79) v1(92.28,28.35) v1(93.56,2.82) v1(93.75,0.91) v1(93.84,65.56) v1(93.84,63.65) v1(93.95,40.79) v1(94.38,61.11) v1(94.42,5.23) v1(94.64,28.35) v1(94.79,16.66) v1(96.31,40.79) v1(97.01,28.35) v1(97.79,16.66) v1(97.98,59.59) v1(98.68,40.79)
VCC33: length 158.8
  Top Layer w0.2: GPS1.7 36.28,54.74 43.18,47.85 v1(43.18,47.52)
  Top Layer w0.3: v1(79.95,31.56) 85.83,31.56 86.05,31.78 86.05,33.05 85.4,33.69 U4.7 ; v1(79.95,36.35) 79.95,37.57 ; U4.1 81.33,35.19 81.47,35.33 81.47,36.79 80.65,37.62 C17.2 ; 86.93,48.92 80.01,48.92 R19.2 ; C16.1 41.21,39.57
  Top Layer w0.8: v1(47.18,47.52) 76.52,47.52 78.85,45.19 OLED1.5 86.12,45.19 86.93,46 86.93,50.53 OLED1.2 ; v1(27.24,35.59) 28.77,37.11 35.37,37.09 ; v1(43.18,47.52) 41.78,46.13 GPS1.23 41.78,40.39 C16.1 40.37,39.57 39.31,38.51 39.31,37.11 39.28,37.08 37.4,37.08 ; R19.2 R18.2 ; v1(14.9,28.94) v1(13.87,28.94) 7.85,28.94 7.01,29.78 U1.21 ; 41.21,39.4 41.41,39.59 C18.2 ; D1.2 36.05,37.08 36.06,37.09 37.4,37.08 ; 37.4,37.08 37.28,37.08 ; 79.95,44.86 79.95,37.8 C17.2
  Bottom Layer w0.3: v1(79.95,31.56) v1(79.95,36.35)
  Bottom Layer w0.8: v1(43.18,47.52) v1(47.18,47.52) ; v1(27.24,35.59) 26.87,35.21 26.87,29.88 25.94,28.94 v1(14.9,28.94) v1(13.87,28.94)
10M: length 18.4
  Top Layer w0.3: U1.16 19.71,29.4 20.13,28.98 26.1,28.98 27.5,30.38 27.5,31.98 28.69,33.17 R6.2
10M_OSC: length 35.8
  Top Layer w0.28: 53.66,40.67 51.12,40.67 49.85,41.94 U3.13 ; 53.66,40.67 65.82,40.67 arc(66.97,40.44) 67.95,39.79 ; 53.66,40.67 U3.10 ; 53.66,40.67 U3.5
  Top Layer w0.3: C7.2 72.52,35.22 67.95,39.79 ; U3.5 53.72,38.03 R13.1
100K: length 32.3
  Top Layer w0.3: U3.2 49.85,36.6 48.96,35.71 29.53,35.71 26.61,32.79 26.61,31.4 26.11,30.9 U1.15
A: length 102.6
  Top Layer w0.3: 90.3,49.05 90.74,49.05 91.89,50.19 94.17,50.19 95.68,48.69 SW2.A 97.98,50.76 97.98,57.18 96.08,59.08 48.33,59.08 42.87,53.62 v1(42.1,53.62)
  Top Layer w0.5: U1.7 17.31,48.03 v1(18.23,48.03)
  Bottom Layer w0.3: v1(18.23,48.03) 19.62,49.43 32.71,49.43 36.9,53.62 v1(42.1,53.62)
B: length 85.4
  Top Layer w0.3: SW2.B 93.43,51.21 90.3,51.21 89.28,52.22 87.7,52.22 87.31,52.6 87.31,55.14 85.41,57.05 48.07,57.05 43.12,52.1 v1(41.98,52.1) ; v1(24.2,47.78) 34.48,47.78 v1(35.25,48.54)
  Top Layer w0.5: U1.8 20.76,47.9 v1(20.77,47.91)
  Bottom Layer w0.3: v1(41.98,52.1) 37.66,52.1 35.25,49.68 v1(35.25,48.54) ; v1(20.77,47.91) 20.89,47.78 v1(24.2,47.78)
PPS: length 66.3
  Top Layer w0.3: U3.1 48.58,39.34 44.64,43.27 44.64,48.03 40.58,52.1 40.58,55.58 GPS1.3 40.68,62.16 37.53,65.3 14.17,65.3 13.44,64.57 13.44,62.8 12.39,61.75 9.58,61.75 R22.2
RXD: length 29.8
  Top Layer w0.3: GPS1.21 39.58,50.17 37.28,52.48 18.17,52.48 R8.2
SCL: length 31.2
  Top Layer w0.3: OLED1.3 84.27,50.19 80.33,54.13 77.92,54.13 77.09,53.3 R18.1 R11.2 ; U4.4 81.61,33.69 82.24,34.32 82.24,43.38 v1(82.57,43.71)
  Bottom Layer w0.3: OLED1.3 82.57,47.99 v1(82.57,43.71)
SDA: length 28.6
  Top Layer w0.3: R12.2 77.03,50.51 R19.1 77.09,49.88 79.27,47.69 OLED1.4 ; v1(83.25,42.95) 82.87,42.57 82.87,33.98 82.08,33.19 U4.5
  Bottom Layer w0.3: v1(83.25,42.95) 83.25,46.17 OLED1.4
SI5351_CLK0: length 3.5
  Top Layer w0.28: U4.10 84.36,35.21 R17.2
SW: length 78.2
  Top Layer w0.3: v1(34.36,48.92) 34.02,48.59 22.94,48.59 U1.9 ; v1(41.34,52.86) 43.12,52.86 48.33,58.07 86.55,58.07 90.3,54.32 90.3,53.36 93.09,53.36 SW2.E
  Bottom Layer w0.3: v1(34.36,48.92) 34.36,49.81 37.4,52.86 v1(41.34,52.86)
TXD: length 24.5
  Top Layer w0.3: R9.2 21.59,51.59 37.02,51.59 38.48,50.13 GPS1.20
VC: length 10.4
  Top Layer w0.3: C6.2 41.79,27.14 O1.3 ; R10.1 36.26,27.14 ; C4.1 36.29,27.11
$1N1: length 21.6
  Top Layer w1: 18.7,7.12 18.59,7.01 16.32,7.01 12.39,10.95 12.39,15.65 ; 18.7,7.12 18.26,7.57 U5.1 ; 18.7,7.12 C23.2 19.96,7.89 U5.2
$1N4: length 6.1
  Top Layer w0.3: U5.5 25.06,9.99 R1.1 R3.2
$1N11: length 19.1
  Top Layer w0.3: R2.2 29.44,28.5 C3.1 ; R2.2 29.08,28.22 18.61,28.22 17.17,29.65 U1.17 ; R2.2 29.72,28.86 29.72,30.89
$1N15: length 1.9
  Top Layer w0.3: R4.1 R5.2
$1N20: length 32.1
  Top Layer w0.3: 52.32,33.17 59.76,33.17 61.66,31.27 O1.1 ; 52.32,33.17 R6.1 ; 52.32,33.17 52.33,33.18 R13.2
$1N25: length 26.6
  Top Layer w0.3: RF1.5 5.02,53.75 28.9,53.75 29.98,54.83 GPS1.11
$1N26: length 13.2
  Top Layer w0.3: 32.05,58.45 32.18,58.32 GPS1.9 ; 32.05,58.45 25.66,58.45 R7.2 ; 32.05,58.45 33.09,58.45 33.28,58.25 GPS1.8
$1N28: length 1.8
  Top Layer w0.3: L1.2 R7.1
$1N35: length 16.3
  Top Layer w0.3: v1(2.95,49.05) 1.93,48.03 1.93,47.65 1.86,47.58 ; R8.1 10.99,51.84 v1(9.97,50.83)
  Bottom Layer w0.3: v1(2.95,49.05) 8.19,49.05 v1(9.97,50.83)
$1N36: length 16.9
  Top Layer w0.3: R9.1 19.43,51.21 19.05,50.83 11.37,50.83 9.84,49.3 5.53,49.3 4.5,48.28 4.5,47.9
$1N37: length 25
  Top Layer w0.203: U3.3 51.12,36.09 49.85,34.82 35.37,34.82 34.51,33.97 34.51,30.98 R5.1
  Top Layer w0.3: R5.1 34.42,28.6 R10.2
$1N42: length 65.2
  Top Layer w0.3: 11.74,47.9 13.91,50.06 36.64,50.06 v1(36.9,50.32) ; v1(45.79,51.59) 47.18,52.98 71.37,52.98 R12.1
  Bottom Layer w0.3: v1(45.79,51.59) 45.53,51.33 37.91,51.33 v1(36.9,50.32)
$1N43: length 62.5
  Top Layer w0.3: v1(43.5,50.7) 43.63,50.7 46.8,53.87 72.9,53.87 73.91,52.86 ; 14.28,47.9 15.88,49.5 37.34,49.5 v1(37.53,49.68)
  Bottom Layer w0.3: v1(37.53,49.68) 38.55,50.7 v1(43.5,50.7)
$1N54: length 9.6
  Top Layer w0.28: R14.2 59.56,45.87 52.94,45.87 52.39,45.33 U3.11
$1N55: length 3.7
  Top Layer w0.28: R15.2 56.42,43.71 U3.8
$1N56: length 47.4
  Top Layer w0.28: R14.1 R15.1 65.18,43.71 arc(67.09,43.33) 68.71,42.25 71.71,39.25 arc(72.8,37.63) 73.18,35.71 73.18,34.4 arc(73.56,32.48) 74.64,30.86 81.31,24.19 arc(82.93,23.11) 84.85,22.73 RF4.5
$1N59: length 6.7
  Top Layer w0.28: C8.1 75.57,35.08 74.05,35.08 73.86,35.28
  Top Layer w0.3: U4.2 76.34,34.69 C8.1
$1N63: length 6.3
  Top Layer w0.28: L3.1 74.42,16.66 C22.2 C11.2 78.49,16.6 L2.2
$1N64: length 4.8
  Top Layer w0.28: R16.1 69.92,19.39 C9.2 70.04,19.26 L3.2 69.98,16.6
$1N65: length 8.8
  Top Layer w0.28: L2.1 83.44,16.66 C12.2 86.68,16.73 C19.1 86.74,14.57 U2.2
$1N84: length 6.5
  Top Layer w0.3: RF2.5 95.57,35.21 R17.1
$1N90: length 32.3
  Top Layer w0.3: GPS1.6 37.38,59.23 35.25,61.37 15.43,61.37 15.05,60.99 15.05,59.12 USB1.6 15.05,57.94 14.84,57.73 14.25,57.73 14.05,57.93 USB1.8
$1N91: length 34.6
  Top Layer w0.3: USB1.7 14.55,61.37 15.31,62.13 v1(16.2,62.13) 35.33,62.13 38.48,58.98 GPS1.5 ; USB1.5 15.56,59.13 15.56,60.48 15.77,60.69 v1(16.2,60.69)
  Bottom Layer w0.3: v1(16.2,60.69) v1(16.2,62.13)
$1N92: length 7.6
  Top Layer w0.3: R20.1 21.08,57.05 17.08,57.05 16.05,58.09 USB1.4
$1N93: length 10.9
  Top Layer w0.3: USB1.10 13.05,57.78 14.8,56.03 R21.1
$1N95: length 11.3
  Top Layer w0.28: RF3.5 93.41,10.38 arc(92.65,10.53) 92,10.96 88.14,14.82 C19.2
$1N1366: length 25.4
  Top Layer w0.28: R16.2 69.92,26.02 arc(69.54,27.94) 68.45,29.56 64.14,33.87 arc(62.52,34.95) 60.61,35.33 55.44,35.33 54.93,35.84 U3.6
$1N3339: length 24.9
  Top Layer w1: 12.39,6.25 8.96,6.25 7.81,7.39 7.81,19.71 11.92,23.81 DC1.1
$1N3564: length 2
  Top Layer w0.3: LED1.2 5.27,58.83 R22.1
$1N8329: length 3
  Top Layer w0.8: R23.2 37.18,38.38 D1.1
$1N8333: length 18.6
  Top Layer w0.8: 37.59,39.78 38.41,39.78 40.68,42.05 GPS1.22 40.68,48.26 v1(41.09,48.67) ; U7.2 46.29,49.59 v1(46.29,49.56)
  Bottom Layer w0.8: v1(41.09,48.67) 41.18,48.76 45.49,48.76 v1(46.29,49.56)

## Copper pours and planes (outline as drawn; the poured copper is in the pictures)
GND on Top Layer: -10.98,77.37 119.19,77.37 119.19,-9.5 -10.98,-9.5
GND on Bottom Layer: -15.05,80.93 122.37,80.93 122.37,-14.07 -15.05,-14.07

## Text on the board
Top Silkscreen Layer: SDA | 3V3 | GND | SCL | 5V | GPS | 10M-OCXO | GPSDO_PICO_V2 | Si5351 | Square | Sine | 一蓑烟雨任平生
